# EAGLE board RK05exNew (EAGLE 6.6.0), part 1 of 2
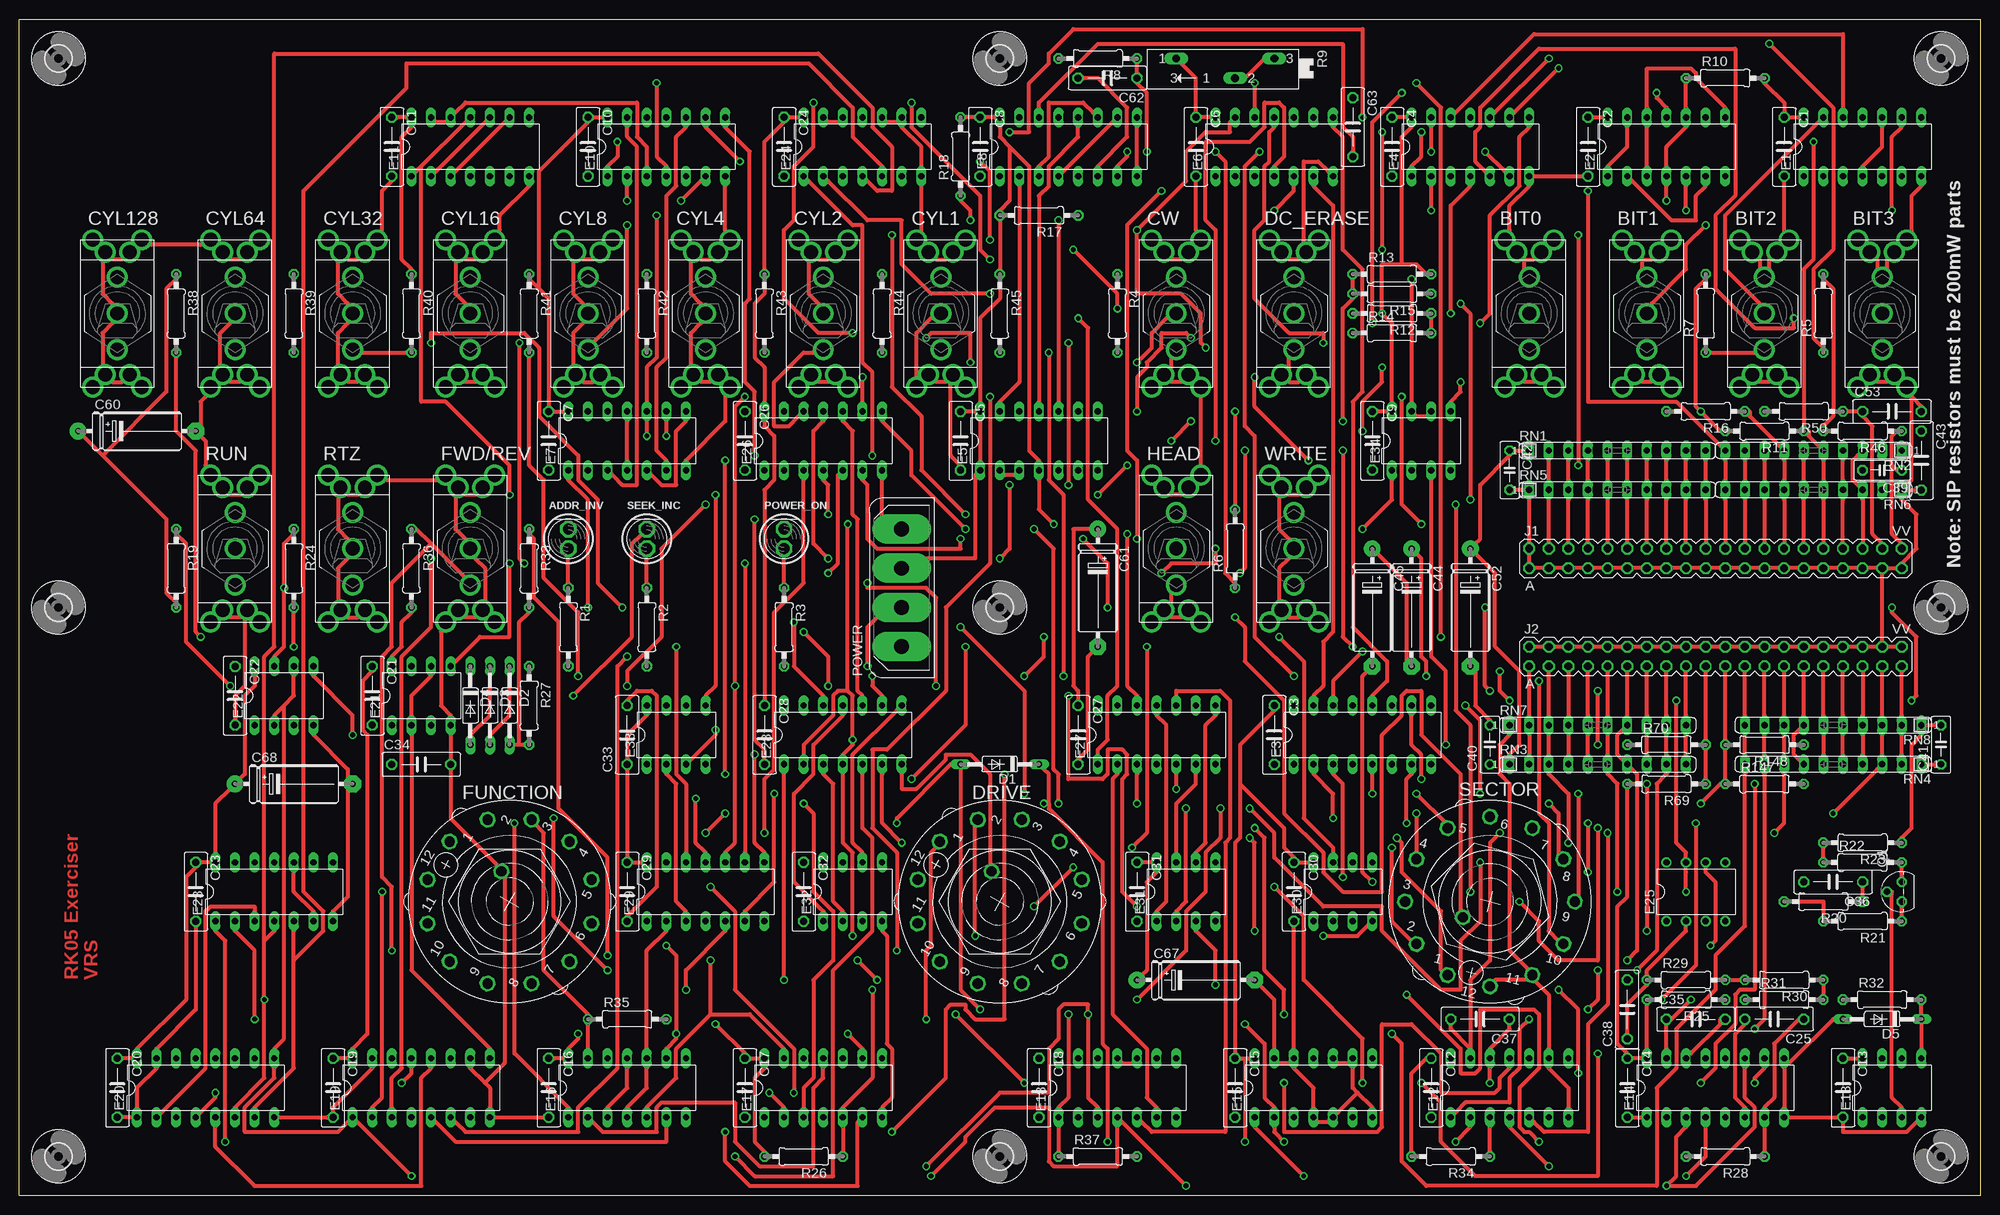
[diagram p5: board, top side]
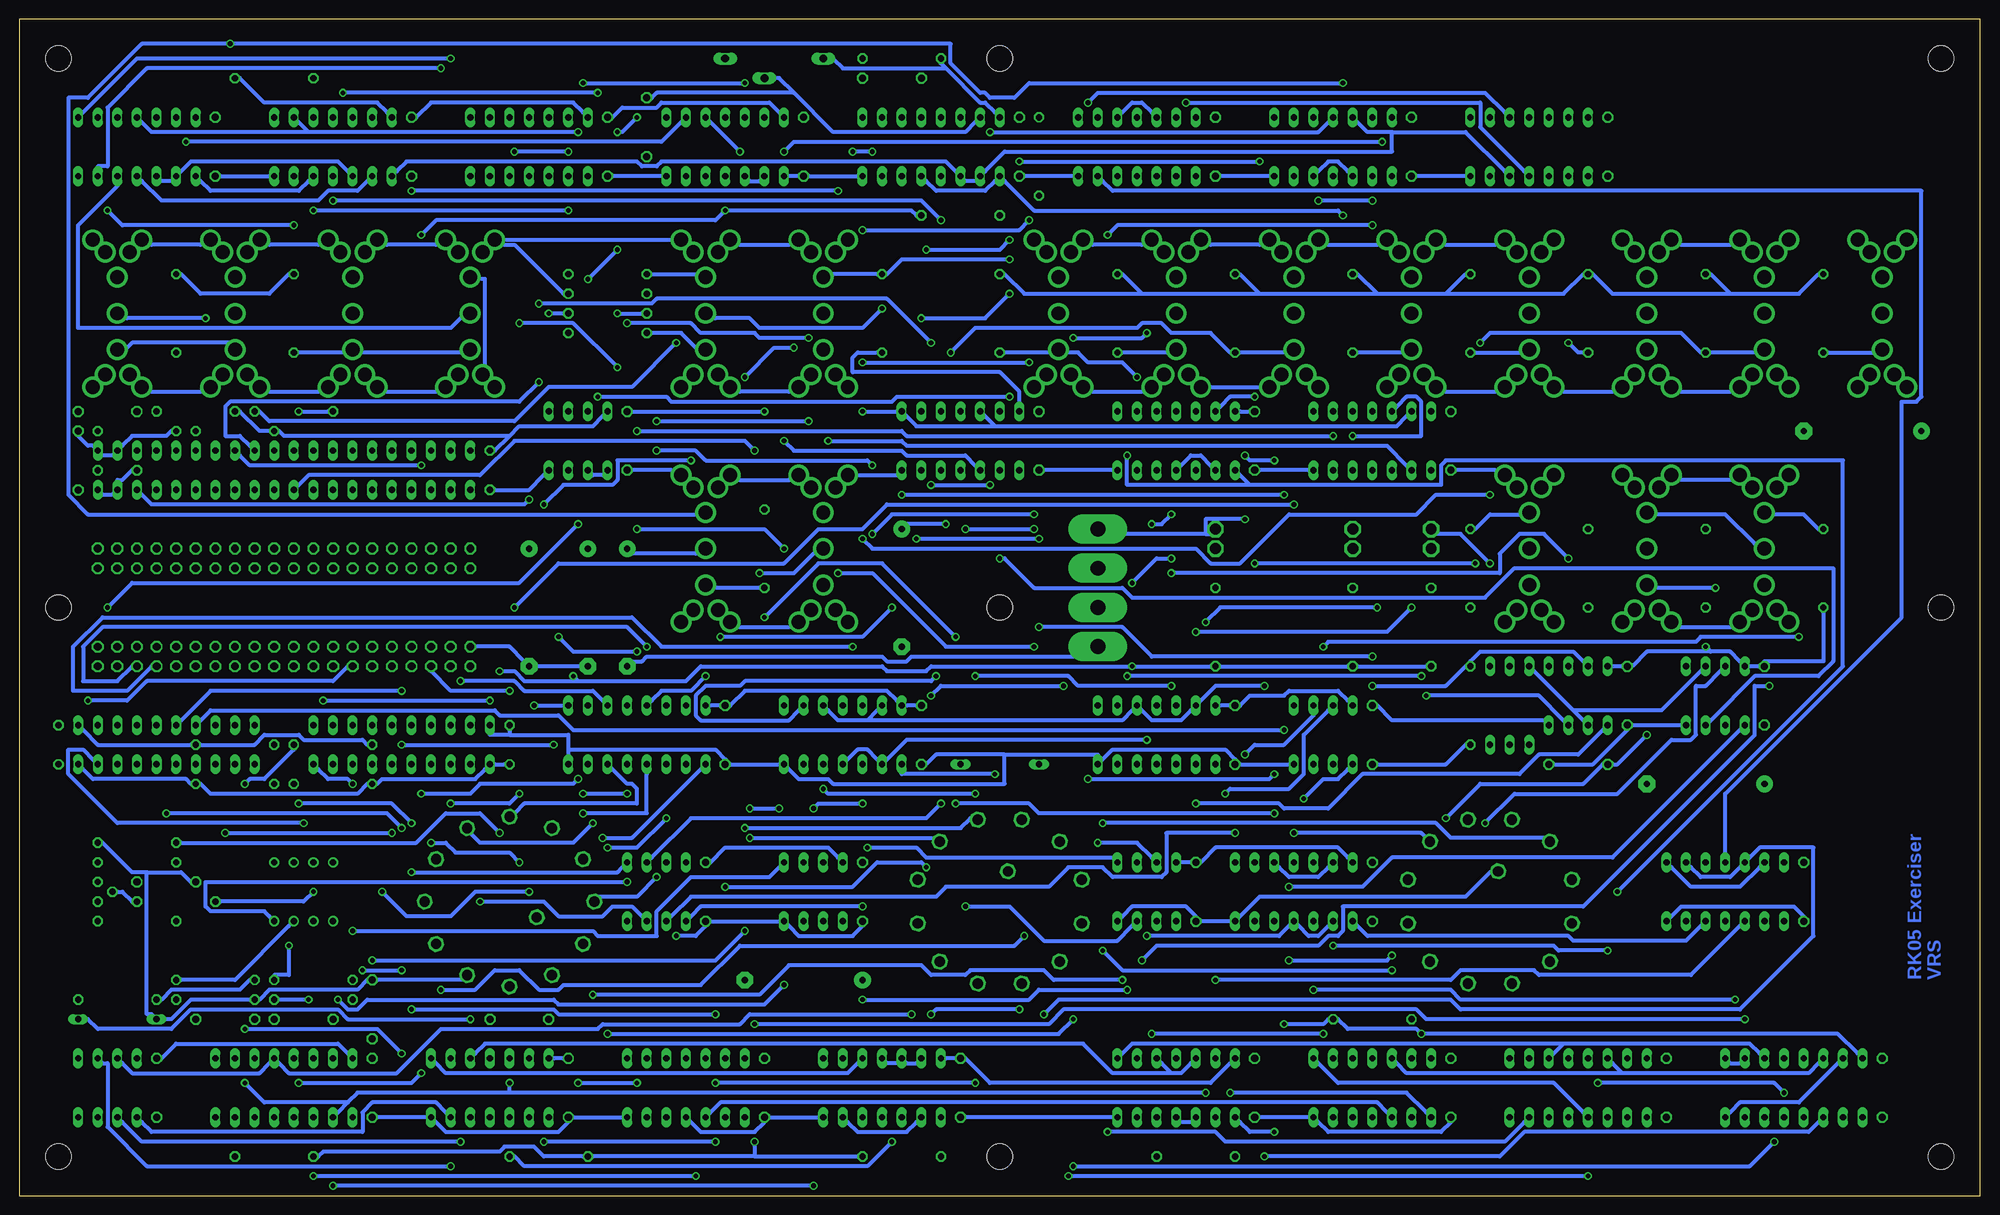
[diagram p6: board, bottom side, seen from below]

Size 254 x 152.4 mm. Coordinates in mm from the lower left corner, seen from the top.
Outline: 0,0 0,152.4 254,152.4 254,0 0,0
Copper layers (1*16): Top 0.035mm / dielectric 1.5mm / Bottom 0.035mm
Design rules "10mils *": minimum track width 10mil, minimum drill 24mil, track to track 10mil, track to pad 10mil, pad to pad 10mil, via to via 10mil, smd to smd 0mil, copper to edge 25mil, drill to drill 10mil, minimum pad ring 10mil, minimum via ring 8mil, stop-mask expansion 0mil, vias tented up to drill 0mil, thermal gap 10mil
Net classes: 0 default: width 0.508 mm, clearance 0.279 mm

## Footprints (pad centres in the part's own frame; a part is rotated, then mirrored left to right if it is on the bottom)
BULB = drill 1.422 octagon: A 0,0; B 0,2.54
7109MD9V3 = drill 1.803: 1 0,4.699; 2 0,0; 3 0,-4.699; NC@1 -3.175,9.525; NC@2 -1.587,7.938; NC@3 3.175,9.525; NC@4 1.587,7.938; NC@5 -3.175,-9.525; NC@6 -1.587,-7.938; NC@7 1.587,-7.938; NC@8 3.175,-9.525
C075-032X103 = drill 0.914 octagon: 1 -3.81,0; 2 3.81,0
C050-025X075 = drill 0.813 octagon: 1 -2.54,0; 2 2.54,0
E15-5 = drill 0.813 pad 2.159: + -7.62,0 | drill 0.813 pad 2.159 octagon: - 7.62,0
DO35-10 = drill 0.813 long: A 5.08,0; C -5.08,0
DO35Z10 = drill 0.813 long: A 5.08,0; C -5.08,0
CK101X12 = drill 1.321 octagon: 1 -2.845,-10.617; 2 -7.772,-7.772; 3 -10.617,-2.845; 4 -10.617,2.845; 5 -7.772,7.772; 6 -2.845,10.617; 7 2.845,10.617; 8 7.772,7.772; 9 10.617,2.845; 10 10.617,-2.845; 11 7.772,-7.772; 12 2.845,-10.617; A -2.87,-2.87
DIL14 = drill 0.813 long: 1 -7.62,-3.81; 2 -5.08,-3.81; 3 -2.54,-3.81; 4 0,-3.81; 5 2.54,-3.81; 6 5.08,-3.81; 7 7.62,-3.81; 8 7.62,3.81; 9 5.08,3.81; 10 2.54,3.81; 11 0,3.81; 12 -2.54,3.81; 13 -5.08,3.81; 14 -7.62,3.81
DIL16 = drill 0.813 long: 1 -8.89,-3.81; 2 -6.35,-3.81; 3 -3.81,-3.81; 4 -1.27,-3.81; 5 1.27,-3.81; 6 3.81,-3.81; 7 6.35,-3.81; 8 8.89,-3.81; 9 8.89,3.81; 10 6.35,3.81; 11 3.81,3.81; 12 1.27,3.81; 13 -1.27,3.81; 14 -3.81,3.81; 15 -6.35,3.81; 16 -8.89,3.81
DIL08 = drill 0.813 long: 1 -3.81,-3.81; 2 -1.27,-3.81; 3 1.27,-3.81; 4 3.81,-3.81; 5 3.81,3.81; 6 1.27,3.81; 7 -1.27,3.81; 8 -3.81,3.81
DIL08' = drill 0.813 pad 1.27: 1 -3.81,-3.81; 2 -1.27,-3.81; 3 1.27,-3.81; 4 3.81,-3.81; 5 3.81,3.81; 6 1.27,3.81; 7 -1.27,3.81; 8 -3.81,3.81
DEC40PINV = drill 1.016 octagon: A -24.13,-1.27; AA 3.81,-1.27; B -24.13,1.27; BB 3.81,1.27; C -21.59,-1.27; CC 6.35,-1.27; D -21.59,1.27; DD 6.35,1.27; E -19.05,-1.27; EE 8.89,-1.27; F -19.05,1.27; FF 8.89,1.27; H -16.51,-1.27; HH 11.43,-1.27; J -16.51,1.27; JJ 11.43,1.27; K -13.97,-1.27; KK 13.97,-1.27; L -13.97,1.27; LL 13.97,1.27; M -11.43,-1.27; MM 16.51,-1.27; N -11.43,1.27; NN 16.51,1.27; P -8.89,-1.27; PP 19.05,-1.27; R -8.89,1.27; RR 19.05,1.27; S -6.35,-1.27; SS 21.59,-1.27; T -6.35,1.27; TT 21.59,1.27; U -3.81,-1.27; UU 24.13,-1.27; V -3.81,1.27; VV 24.13,1.27; W -1.27,-1.27; X -1.27,1.27; Y 1.27,-1.27; Z 1.27,1.27
FLOPPY-4 = drill 1.93 pad 3.81 long: 1 7.62,0; 2 2.54,0; 3 -2.54,0; 4 -7.62,0
TO92E = drill 0.813 octagon: B1 -1.27,0; B2 1.27,0; E 0,1.905
0207/10 = drill 0.813 octagon: 1 -5.08,0; 2 5.08,0
SP19L = drill 1.016 long: A 5.715,-1.27; E -6.985,-1.27; S -1.905,1.27
SIL10 = drill 0.813 long: 1 -11.43,0; 2 -8.89,0; 3 -6.35,0; 4 -3.81,0; 5 -1.27,0; 6 1.27,0; 7 3.81,0; 8 6.35,0; 9 8.89,0; 10 11.43,0
3,3 = hole 3.3: 0,0

## Placement (x,y rotation side)
ADDR_INV  [BULB]  71.12,83.82 0 top
BIT0  7101  [7109MD9V3]  195.58,114.3 0 top
BIT1  7101  [7109MD9V3]  210.82,114.3 0 top
BIT2  7101  [7109MD9V3]  226.06,114.3 0 top
BIT3  7101  [7109MD9V3]  241.3,114.3 0 top
C1  .01uf  [C075-032X103]  228.6,135.89 270 top
C2  .01uf  [C075-032X103]  203.2,135.89 270 top
C3  .01uf  [C075-032X103]  162.56,59.69 270 top
C4  .01uf  [C075-032X103]  177.8,135.89 270 top
C5  .01uf  [C075-032X103]  121.92,97.79 270 top
C6  .01uf  [C075-032X103]  152.4,135.89 270 top
C7  .01uf  [C075-032X103]  68.58,97.79 270 top
C8  .01uf  [C075-032X103]  124.46,135.89 270 top
C9  .01uf  [C075-032X103]  175.26,97.79 270 top
C10  .01uf  [C075-032X103]  73.66,135.89 270 top
C11  .01uf  [C075-032X103]  48.26,135.89 270 top
C12  .01uf  [C075-032X103]  182.88,13.97 270 top
C13  .01uf  [C075-032X103]  236.22,13.97 270 top
C14  .01uf  [C075-032X103]  208.28,13.97 270 top
C15  .01uf  [C075-032X103]  157.48,13.97 270 top
C16  .01uf  [C075-032X103]  68.58,13.97 270 top
C17  .01uf  [C075-032X103]  93.98,13.97 270 top
C18  .01uf  [C075-032X103]  132.08,13.97 270 top
C19  .01uf  [C075-032X103]  40.64,13.97 270 top
C20  .01uf  [C075-032X103]  12.7,13.97 270 top
C21  .01uf  [C075-032X103]  45.72,64.77 270 top
C22  .01uf  [C075-032X103]  27.94,64.77 270 top
C23  .01uf  [C075-032X103]  22.86,39.37 270 top
C24  .01uf  [C075-032X103]  99.06,135.89 270 top
C25  470pf  [C075-032X103]  227.33,22.86 180 top
C26  .01uf  [C075-032X103]  93.98,97.79 270 top
C27  .01uf  [C075-032X103]  137.16,59.69 270 top
C28  .01uf  [C075-032X103]  96.52,59.69 270 top
C29  .01uf  [C075-032X103]  78.74,39.37 270 top
C30  .01uf  [C075-032X103]  165.1,39.37 270 top
C31  .01uf  [C075-032X103]  144.78,39.37 270 top
C32  .01uf  [C075-032X103]  101.6,39.37 270 top
C33  .01uf  [C075-032X103]  78.74,59.69 90 top
C34  .001uf  [C075-032X103]  52.07,55.88 0 top
C35  470pf  [C075-032X103]  217.17,22.86 0 top
C36  .033uf  [C075-032X103]  234.95,40.64 180 top
C37  .001uf  [C075-032X103]  189.23,22.86 180 top
C38  100pf  [C075-032X103]  208.28,24.13 90 top
C39  .001  [C050-025X075]  241.3,93.98 180 top
C40  .22uf  [C050-025X075]  190.5,58.42 90 top
C41  .22uf  [C050-025X075]  248.92,58.42 90 top
C42  .22uf  [C050-025X075]  193.04,93.98 270 top
C43  .22uf  [C075-032X103]  246.38,95.25 270 top
C44  6.8uf  [E15-5]  180.34,76.2 270 top
C45  6.8uf  [E15-5]  175.26,76.2 270 top
C52  39uf  [E15-5]  187.96,76.2 270 top
C53  .001  [C075-032X103]  242.57,101.6 0 top
C60  6.8uf  [E15-5]  15.24,99.06 0 top
C61  6.8uf  [E15-5]  139.7,78.74 270 top
C62  27pf  [C075-032X103]  140.97,144.78 180 top
C63  47pf  [C075-032X103]  172.72,138.43 270 top
C67  6.8uf  [E15-5]  152.4,27.94 0 top
C68  6.8uf  [E15-5]  35.56,53.34 0 top
CW  7101  [7109MD9V3]  149.86,114.3 0 top
CYL1  7101  [7109MD9V3]  119.38,114.3 0 top
CYL2  7101  [7109MD9V3]  104.14,114.3 0 top
CYL4  7101  [7109MD9V3]  88.9,114.3 0 top
CYL8  7101  [7109MD9V3]  73.66,114.3 0 top
CYL16  7101  [7109MD9V3]  58.42,114.3 0 top
CYL32  7101  [7109MD9V3]  43.18,114.3 0 top
CYL64  7101  [7109MD9V3]  27.94,114.3 0 top
CYL128  7101  [7109MD9V3]  12.7,114.3 0 top
D1  D664  [DO35-10]  127,55.88 180 top
D2  D664  [DO35-10]  63.5,63.5 270 top
D3  D664  [DO35-10]  60.96,63.5 270 top
D4  D664  [DO35-10]  58.42,63.5 270 top
D5  1N746  [DO35Z10]  241.3,22.86 180 top
DC_ERASE  7101  [7109MD9V3]  165.1,114.3 0 top
DRIVE  [CK101X12]  127,38.1 240 top
E1  74LS10N  [DIL14]  238.76,135.89 0 top
E2  74LS74N  [DIL14]  213.36,135.89 0 top
E3  74LS42N  [DIL16]  173.99,59.69 0 top
E4  74LS20N  [DIL14]  187.96,135.89 0 top
E5  74LS74N  [DIL14]  132.08,97.79 0 top
E6  74LS04N  [DIL14]  162.56,135.89 0 top
E7  74LS00N  [DIL14]  78.74,97.79 0 top
E8  74123N  [DIL16]  135.89,135.89 0 top
E10  74LS00N  [DIL14]  83.82,135.89 0 top
E11  74LS74N  [DIL14]  58.42,135.89 0 top
E12  74LS04N  [DIL14]  193.04,13.97 0 top
E13  DS75451N  [DIL08]  242.57,13.97 0 top
E14  74123N  [DIL16]  219.71,13.97 0 top
E15  74LS00N  [DIL14]  167.64,13.97 0 top
E16  74LS10N  [DIL14]  78.74,13.97 0 top
E17  74LS00N  [DIL14]  104.14,13.97 0 top
E18  74LS74N  [DIL14]  142.24,13.97 0 top
E19  74LS193N  [DIL16]  52.07,13.97 0 top
E20  74LS193N  [DIL16]  24.13,13.97 0 top
E21  DS75451N  [DIL08]  52.07,64.77 0 top
E22  DS75451N  [DIL08]  34.29,64.77 0 top
E23  74LS10N  [DIL14]  33.02,39.37 0 top
E24  74LS20N  [DIL14]  109.22,135.89 0 top
E25  LM741P  [DIL08']  217.17,39.37 0 top
E26  74LS00N  [DIL14]  104.14,97.79 0 top
E27  74LS00N  [DIL14]  147.32,59.69 0 top
E28  74LS00N  [DIL14]  106.68,59.69 0 top
E29  74LS00N  [DIL14]  88.9,39.37 0 top
E30  DS75451N  [DIL08]  171.45,39.37 0 top
E31  DS75451N  [DIL08]  151.13,39.37 0 top
E32  DS75451N  [DIL08]  107.95,39.37 0 top
E33  DS75451N  [DIL08]  85.09,59.69 0 top
E34  DS75451N  [DIL08]  181.61,97.79 0 top
FUNCTION  [CK101X12]  63.5,38.1 240 top
FWD/REV  7101  [7109MD9V3]  58.42,83.82 0 top
HEAD  7101  [7109MD9V3]  149.86,83.82 0 top
J1  DEC40PINSV  [DEC40PINV]  219.71,82.55 0 top
J2  DEC40PINSV  [DEC40PINV]  219.71,69.85 0 top
POWER  [FLOPPY-4]  114.3,78.74 90 top
POWER_ON  [BULB]  99.06,83.82 0 top
Q1  2N4894  [TO92E]  243.84,39.37 90 top
R1  0ohm  [0207/10]  71.12,73.66 270 top
R2  0ohm  [0207/10]  81.28,73.66 270 top
R3  0ohm  [0207/10]  99.06,73.66 270 top
R4  1K  [0207/10]  142.24,114.3 270 top
R5  56K  [0207/10]  233.68,114.3 90 top
R6  56K  [0207/10]  157.48,83.82 90 top
R7  1K  [0207/10]  218.44,114.3 90 top
R8  5.6k  [0207/10]  139.7,147.32 180 top
R9  10K  [SP19L]  155.57,146.05 180 top
R10  1K  [0207/10]  220.98,144.78 0 top
R11  1K  [0207/10]  226.06,99.06 180 top
R12  330  [0207/10]  177.8,114.3 180 top
R13  330  [0207/10]  177.8,119.38 0 top
R14  750  [0207/10]  177.8,111.76 0 top
R15  750  [0207/10]  177.8,116.84 180 top
R16  1K  [0207/10]  218.44,101.6 180 top
R17  1K  [0207/10]  132.08,127 180 top
R18  1K  [0207/10]  121.92,134.62 90 top
R19  1K  [0207/10]  20.32,81.28 270 top
R20  470K  [0207/10]  233.68,38.1 180 top
R21  330  [0207/10]  238.76,35.56 180 top
R22  120  [0207/10]  238.76,43.18 0 top
R23  68  [0207/10]  238.76,45.72 180 top
R24  1K  [0207/10]  35.56,81.28 270 top
R25  10K  [0207/10]  215.9,25.4 180 top
R26  1K  [0207/10]  101.6,5.08 180 top
R27  1K  [0207/10]  66.04,63.5 270 top
R28  22K  [0207/10]  220.98,5.08 180 top
R29  100K  [0207/10]  215.9,27.94 0 top
R30  100K  [0207/10]  228.6,27.94 180 top
R31  1M  [0207/10]  228.6,25.4 0 top
R32  1K  [0207/10]  241.3,25.4 0 top
R33  1K  [0207/10]  66.04,81.28 270 top
R34  1K  [0207/10]  185.42,5.08 180 top
R35  1K  [0207/10]  78.74,22.86 0 top
R36  1K  [0207/10]  50.8,81.28 270 top
R37  1K  [0207/10]  139.7,5.08 0 top
R38  1K  [0207/10]  20.32,114.3 270 top
R39  1K  [0207/10]  35.56,114.3 270 top
R40  1K  [0207/10]  50.8,114.3 270 top
R41  1K  [0207/10]  66.04,114.3 270 top
R42  1K  [0207/10]  81.28,114.3 270 top
R43  1K  [0207/10]  96.52,114.3 270 top
R44  1K  [0207/10]  111.76,114.3 270 top
R45  1K  [0207/10]  127,114.3 270 top
R46  390  [0207/10]  238.76,99.06 180 top
R50  390  [0207/10]  231.14,101.6 180 top
R69  180  [0207/10]  213.36,53.34 180 top
R70  390  [0207/10]  213.36,58.42 0 top
R147  180  [0207/10]  226.06,53.34 0 top
R148  390  [0207/10]  226.06,58.42 180 top
RN1  180  [SIL10]  207.01,96.52 0 top
RN2  180  [SIL10]  232.41,96.52 180 top
RN3  180  [SIL10]  204.47,55.88 0 top
RN4  180  [SIL10]  234.95,55.88 180 top
RN5  390  [SIL10]  207.01,91.44 0 top
RN6  390  [SIL10]  232.41,91.44 180 top
RN7  390  [SIL10]  204.47,60.96 0 top
RN8  390  [SIL10]  234.95,60.96 180 top
RTZ  7101  [7109MD9V3]  43.18,83.82 0 top
RUN  7101  [7109MD9V3]  27.94,83.82 0 top
SECTOR  [CK101X12]  190.5,38.1 345 top
SEEK_INC  [BULB]  81.28,83.82 0 top
U$1  [3,3]  5.08,147.32 0 top
U$2  [3,3]  5.08,5.08 0 top
U$3  [3,3]  5.08,76.2 0 top
U$4  [3,3]  248.92,147.32 0 top
U$5  [3,3]  248.92,5.08 0 top
U$6  [3,3]  248.92,76.2 0 top
U$7  [3,3]  127,147.32 0 top
U$8  [3,3]  127,5.08 0 top
U$9  [3,3]  127,76.2 0 top
WRITE  7108  [7109MD9V3]  165.1,83.82 0 top

## Tracks (layer width: path | path; a pad name or v marks a point on that pad's centre or on a via)
0BIT  (via drill 0.61)
  Top 0.508: v199.39,146.05 193.68,140.34 E4.9
  Bottom 0.508: v199.39,146.05 237.49,146.05 242.57,140.97 242.57,133.35 243.84,133.35 E1.6
1.44MHZ
  Top 0.508: E5.11 132.08,102.87 132.08,129.54 133.35,130.81 133.35,133.35 137.16,137.16 137.16,138.43 E8.12
1BIT  (via drill 0.61)
  Top 0.508: v198.12,147.32 191.13,140.34 E4.10
  Bottom 0.508: v198.12,147.32 238.76,147.32 245.75,140.34 E1.8
1L  (via drill 0.61)
  Top 0.508: v212.09,142.88 212.09,142.24 213.36,140.97 E2.11 | v179.07,142.88 175.26,139.06 v175.26,113.03 | v151.76,111.12 151.13,111.76 147.96,111.76 147.96,109.86 146.05,107.95 146.05,107.31 144.78,106.05 v144.78,101.6
  Bottom 0.508: 127.64,99.69 75.56,99.69 74.3,100.97 E7.13 | 127.64,99.69 128.91,100.97 E5.12 | 127.64,99.69 137.79,99.69 139.06,100.97 E5.8 140.34,101.6 v144.78,101.6 | v179.07,142.88 v212.09,142.88 | v175.26,113.03 167,113.03 165.74,111.76 158.75,111.76 158.12,111.12 v151.76,111.12
2.88MHZ
  Top 0.508: E8.4 135.25,132.72 141.6,139.06 E8.10
2BIT
  Top 0.508: E4.12 186.06,140.34 196.22,150.5 236.22,150.5 236.22,140.97 E1.12
2H  (via drill 0.61)
  Top 0.508: v181.61,137.79 181.61,134.62 180.34,133.35 E4.1
  Bottom 0.508: v181.61,137.79 216.53,137.79 | 216.53,137.79 217.81,139.06 E2.9 | 216.53,137.79 236.85,137.79 238.12,139.06 E1.11
2L
  Top 0.508: E2.3 210.82,133.35 210.82,138.43 E2.12 210.82,140.97 210.82,146.05 216.53,146.05 217.17,145.41 217.17,144.78 220.98,140.97 E2.8
  Bottom 0.508: E1.3 235.59,131.44 234.31,131.44 E1.2 233.04,132.72 231.78,133.99 212.72,133.99 211.46,132.72 E2.3
3BIT  (via drill 0.61)
  Top 0.508: v182.88,135.25 182.88,138.43 E4.13 | v189.87,135.25 192.41,132.72 E4.6
  Bottom 0.508: v182.88,135.25 v189.87,135.25
4H  (via drill 0.61)
  Top 0.508: v182.88,127.64 182.88,130.81 E4.2 | v215.9,127.64 215.9,130.81 E2.5
  Bottom 0.508: v182.88,127.64 v215.9,127.64 | E1.1 230.5,131.44 229.24,130.18 217.81,130.18 216.53,131.44 E2.5
4L
  Top 0.508: E1.4 238.76,133.35 241.3,135.89 241.3,138.43 E1.10 | E2.2 208.91,131.44 214,126.36 217.17,126.36 217.17,129.54 218.44,130.81 E2.6
  Bottom 0.508: E1.4 238.12,131.44 235.59,128.91 215.26,128.91 214,130.18 210.19,130.18 208.91,131.44 E2.2
202_DETECT_L
  Bottom 0.508: E23.11 33.02,44.45 33.02,52.07 10.16,74.93 10.16,102.87 8.26,102.87 7.62,103.5 7.62,130.18 112.39,130.18 113.67,131.44 E24.6
+3V  (via drill 0.61)
  Top 0.508: 34.29,63.5 35.56,64.77 35.56,67.31 E22.6 | 34.29,63.5 33.02,62.23 E22.2 | E19.9 60.96,19.05 50.8,29.21 50.8,59.69 E21.2 50.8,62.23 50.8,64.77 53.34,67.31 E21.6 | 34.29,63.5 34.29,20.32 33.02,19.05 E20.9 33.02,16.51 33.02,15.24 29.21,11.43 29.21,8.26 41.27,8.26 42.55,9.53 E19.1 43.81,9.53 v50.8,2.54 | v151.13,1.27 142.88,9.53 E18.4 142.24,8.89 142.24,3.81 133.99,3.81 133.35,4.45 133.35,11.43 126.36,11.43 122.56,7.62 122.56,6.99 v118.11,2.54 | E14.3 215.9,8.89 214.63,7.62 214.63,2.54 v213.36,1.27 217.17,1.27 224.79,8.89 224.79,11.43 223.52,12.7 223.52,16.51 E14.11
  Bottom 0.508: E20.10 31.11,17.14 32.38,17.14 E20.9 | 52.7,62.87 51.44,61.59 E21.2 | 52.7,62.87 57.78,67.94 D4.C | 52.7,62.87 41.27,62.87 36.2,67.94 E22.6 | v151.13,1.27 v213.36,1.27 | v50.8,2.54 v118.11,2.54
+3VA  (via drill 0.61)
  Top 0.508: v151.76,100.33 v149.22,97.79 | v171.45,100.33 171.45,114.94 172.72,116.2 R15.2 172.72,117.47 172.72,118.75 R13.1
  Bottom 0.508: v149.22,97.79 139.7,97.79 139.06,97.16 76.83,97.16 74.3,94.61 E7.2 | v171.45,100.33 v151.76,100.33 | DC_ERASE.1 166.37,119.38 172.09,119.38 R13.1
+3VB  (via drill 0.61)
  Top 0.508: R14.2 182.88,112.39 182.88,113.67 R12.1 | v185.42,114.3 185.42,128.27 187.96,130.81 E4.4
  Bottom 0.508: v185.42,114.3 183.51,114.3 R12.1
+3VC  (via drill 0.61)
  Top 0.508: E11.2 53.98,132.72 60.33,139.06 E11.10 | v125.73,121.28 124.46,122.56 124.46,129.54 115.57,138.43 v115.57,141.6
  Bottom 0.508: CW.1 148.59,119.38 142.88,119.38 R4.1 141.6,119.38 139.7,121.28 v125.73,121.28 | v115.57,141.6 114.3,142.88 64.14,142.88 61.59,140.34 E11.10
+15V  (via drill 0.61)
  Top 0.508: R20.2 229.24,38.1 233.68,38.1 233.68,36.2 R21.2 | v215.9,39.37 215.9,41.91 E25.7 215.9,44.45 214.63,45.72 v214.63,64.14 | v182.25,67.31 182.25,69.22 181.61,69.85 181.61,82.55 180.97,83.19 C44.+ | v109.86,68.58 109.86,73.66 111.12,74.93 POWER.3 | v193.04,64.14 191.77,65.41 v191.77,67.94
  Bottom 0.508: v215.9,39.37 217.17,38.1 227.97,38.1 R20.2 | R1.2 71.75,68.58 80.64,68.58 R2.2 81.92,68.58 98.42,68.58 R3.2 99.69,68.58 v109.86,68.58 135.89,68.58 136.53,67.94 141.6,67.94 142.24,68.58 165.74,68.58 167.64,66.67 181.61,66.67 | 181.61,66.67 v182.25,67.31 | v214.63,64.14 v193.04,64.14 | v191.77,67.94 189.87,67.94 188.59,66.67 181.61,66.67
-15V  (via drill 0.61)
  Top 0.508: v175.26,40.64 173.99,41.91 173.99,67.31 174.62,67.94 C45.-
  Bottom 0.508: v175.26,40.64 229.87,40.64 229.87,37.47 229.24,36.83 222.25,36.83 221.62,36.2 E25.4 | POWER.4 117.47,69.85 138.43,69.85 139.06,69.22 141.6,69.22 142.24,69.85 172.72,69.85 173.35,69.22 174.62,69.22 C45.-
ADDR_COUNTER_1  (via drill 0.61)
  Top 0.508: v53.34,82.55 53.34,73.66 49.53,69.85 49.53,16.51 48.26,15.24 48.26,11.43 E19.3 | v104.78,80.64 106.05,81.92 106.05,93.34 E26.5
  Bottom 0.508: v53.34,82.55 56.52,85.72 59.69,85.72 62.23,83.19 62.23,80.64 v104.78,80.64
ADDR_COUNTER_2  (via drill 0.61)
  Top 0.508: v46.99,39.37 46.99,12.7 45.72,11.43 E19.2 | v110.49,95.89 110.49,106.68 109.22,107.95 109.22,125.73 107.95,125.73 102.23,131.44 E24.1
  Bottom 0.508: v46.99,39.37 17.78,68.58 17.78,95.25 69.22,95.25 69.85,94.61 69.85,92.08 94.61,92.08 | 94.61,92.08 95.89,93.34 E26.1 | v110.49,95.89 110.49,92.08 94.61,92.08
ADDR_COUNTER_4  (via drill 0.61)
  Top 0.508: v78.74,69.85 77.47,68.58 77.47,16.51 72.39,11.43 72.39,8.26 57.78,8.26 56.52,9.53 E19.6 | v121.92,73.66 130.18,65.41 v130.18,52.07 | v149.86,52.7 149.86,54.61 E27.5
  Bottom 0.508: v78.74,69.85 107.31,69.85 111.12,73.66 v121.92,73.66 | v130.18,52.07 149.22,52.07 v149.86,52.7
ADDR_COUNTER_8  (via drill 0.61)
  Top 0.508: v113.03,8.26 120.02,15.24 120.02,24.13 120.65,24.77 122.56,24.77 122.56,24.13 123.83,22.86 127.64,22.86 v127.64,54.61 | v125.73,116.84 118.11,116.84 114.3,120.65 114.3,126.36 109.86,126.36 104.78,131.44 E24.2 | v137.16,113.67 138.43,112.39 138.43,90.17 142.24,86.36 142.24,66.04 140.97,64.77 140.97,59.05 139.7,57.78 139.7,57.15 E27.1
  Bottom 0.508: v113.03,8.26 99.06,8.26 97.79,6.99 61.59,6.99 59.05,9.53 E19.7 | v127.64,54.61 139.7,54.61 E27.1 | v125.73,116.84 128.91,113.67 v137.16,113.67
ADDR_COUNTER_16  (via drill 0.61)
  Top 0.508: v92.71,5.08 95.25,2.54 105.41,2.54 105.41,29.21 110.49,34.29 110.49,46.35 109.22,47.62 109.22,54.61 E28.5
  Bottom 0.508: v92.71,5.08 62.23,5.08 59.05,8.26 22.23,8.26 20.95,9.53 E20.3
ADDR_COUNTER_32  (via drill 0.61)
  Top 0.508: E20.2 18.41,10.79 24.13,16.51 24.13,36.83 24.77,37.47 30.48,37.47 30.48,36.83 E23.3 | v99.06,27.94 99.06,54.61 E28.1
  Bottom 0.508: v99.06,27.94 68.58,27.94 67.31,29.21 57.78,29.21 57.15,28.57 37.47,28.57 31.11,34.92 E23.3
ADDR_COUNTER_64  (via drill 0.61)
  Top 0.508: 31.75,33.02 v31.75,25.4 31.75,15.24 27.94,11.43 E20.6 | 31.75,33.02 33.02,34.29 E23.4 | v86.36,26.67 86.36,29.21 91.44,34.29 E29.5 | 31.75,33.02 31.75,69.85 33.02,71.12 33.02,147.96 103.5,147.96 110.49,140.97 110.49,138.43 113.03,135.89 113.03,130.18 111.12,130.18 109.86,131.44 E24.4
  Bottom 0.508: v86.36,26.67 68.58,26.67 67.31,25.4 v31.75,25.4
ADDR_COUNTER_128
  Top 0.508: 35.56,30.48 35.56,34.29 E23.5 | 35.56,30.48 35.56,16.51 30.48,11.43 E20.7 | 35.56,30.48 39.37,34.29 39.37,36.83 36.83,39.37 36.83,130.18 50.16,143.51 50.16,146.69 102.23,146.69 107.95,140.97 107.95,137.16 111.76,133.35 E24.5
  Bottom 0.508: E29.1 80.64,34.92 79.38,33.66 53.34,33.66 52.7,33.02 38.1,33.02 36.2,34.92 E23.5
ADDR_SOURCE_H  (via drill 0.61)
  Top 0.508: v93.98,103.5 92.71,102.23 v92.71,66.04 92.71,45.72 91.44,44.45 E29.10 | E26.10 106.68,100.33 107.95,99.06 107.95,88.27 108.58,87.63 108.58,65.41 109.22,64.77 E28.10 | E18.5 145.41,9.53 146.69,8.26 156.21,8.26 156.21,45.72 156.84,46.35 156.84,64.14 155.57,65.41 149.86,65.41 149.86,64.77 E27.10
  Bottom 0.508: E29.13 84.45,42.55 85.72,41.27 89.53,41.27 90.81,42.55 E29.10 | v93.98,103.5 97.16,103.5 98.42,102.23 E26.13 | 144.15,61.59 142.88,62.87 E27.13 | 144.15,61.59 147.96,61.59 149.22,62.87 E27.10 | 144.15,61.59 111.12,61.59 109.86,62.87 E28.10 108.58,62.87 107.31,61.59 103.5,61.59 102.23,62.87 E28.13 100.97,64.14 99.06,66.04 v92.71,66.04
ADDR_SOURCE_L  (via drill 0.61)
  Top 0.508: E27.2 142.24,54.61 141.6,53.98 141.6,23.5 146.05,19.05 146.05,12.7 147.32,11.43 E18.6 | E16.4 78.74,11.43 81.28,13.97 81.28,16.51 E16.10 81.28,19.05 81.28,31.75 83.82,34.29 E29.2 | 107.31,65.41 106.05,65.41 105.41,64.77 105.41,62.23 101.6,58.42 101.6,57.15 E28.2 | 107.31,65.41 107.95,64.77 v107.95,59.05 107.95,58.42 106.68,57.15 E28.4 106.68,54.61 106.68,45.72 107.95,44.45 v107.95,33.66 | v104.78,88.27 104.78,92.08 104.14,92.71 E26.4 | 107.31,65.41 v107.31,87
  Bottom 0.508: E27.4 146.69,56.52 145.41,57.78 144.15,57.78 142.88,56.52 E27.2 141.6,56.52 139.06,59.05 v107.95,59.05 | E18.2 137.79,9.53 139.06,8.26 145.41,8.26 146.69,9.53 E18.6 | E29.2 84.45,34.92 85.72,33.66 87,33.66 88.27,34.92 E29.4 89.53,34.92 90.81,33.66 v107.95,33.66 | E26.2 99.69,94.61 100.97,95.89 102.23,95.89 103.5,94.61 E26.4 | v104.78,88.27 106.05,87 v107.31,87
ADDRESS_INVALID_L  (via drill 0.61)
  Top 0.508: v63.5,81.92 63.5,72.39 59.69,72.39 56.52,69.22 E21.5
  Bottom 0.508: v63.5,81.92 67.31,85.72 70.48,85.72 ADDR_INV.B
BIT_0L
  Bottom 0.508: E1.5 241.3,130.81 246.38,125.73 246.38,112.39 198.12,112.39 196.85,113.67 BIT0.2
BIT_1L  (via drill 0.61)
  Top 0.508: v242.57,127.64 242.57,137.16 243.84,138.43 E1.9 | v218.44,125.73 215.9,123.19 215.9,120.02 211.46,115.57 BIT1.2
  Bottom 0.508: v242.57,127.64 240.66,125.73 v218.44,125.73
BIT_2L
  Top 0.508: E1.13 233.04,139.06 220.98,127 220.98,120.02 225.43,115.57 BIT2.2
BIT_3L  (via drill 0.61)
  Top 0.508: v229.87,113.67 229.87,112.39 224.79,112.39 219.71,117.47 219.71,127 222.25,129.54 222.25,148.59 196.85,148.59 189.23,140.97 189.23,138.43 188.59,137.79 188.59,133.99 189.87,132.72 E4.5
  Bottom 0.508: v229.87,113.67 240.03,113.67 BIT3.2
BUS_AC_LO_L
  Top 0.508: 242.57,94.61 243.21,93.98 C39.1 | 242.57,94.61 242.57,98.42 243.21,99.06 R46.1 | 242.57,94.61 242.57,85.72 243.84,84.45 J1.VV
BUS_ADDR_ACCEPTED_L
  Top 0.508: RN3.5 203.2,57.15 203.2,59.69 RN7.5 203.2,62.23 203.2,67.94 J2.H
BUS_ADDRESS_INVALID_L  (via drill 0.61)
  Top 0.508: R26.1 106.68,5.71 106.68,8.89 E17.5 106.68,11.43 110.49,15.24 v110.49,26.67 | J2.C 198.12,67.94 198.12,62.23 RN7.3 198.12,59.69 198.12,57.15 RN3.3 198.12,54.61 200.66,52.07 v200.66,45.72 | v144.78,25.4 151.13,31.75 151.13,36.83 153.67,39.37 153.67,44.45 155.57,46.35 v155.57,50.16 | v159.38,50.16 162.56,46.99 162.56,43.81 168.91,37.47 176.53,37.47 176.53,34.29 184.15,26.67 186.69,26.67 186.69,33.02 189.23,35.56 v189.23,43.18
  Bottom 0.508: v110.49,26.67 121.92,26.67 123.19,25.4 v144.78,25.4 | v159.38,50.16 v155.57,50.16 | v189.23,43.18 190.5,44.45 197.49,44.45 198.75,45.72 v200.66,45.72
BUS_CA_00_L  (via drill 0.61)
  Top 0.508: v203.2,48.26 v203.2,41.91 | v217.81,50.8 220.34,53.34 R147.1 220.98,53.98 220.98,57.78 R148.2 220.98,59.05 220.98,67.94 J2.Y
  Bottom 0.508: v203.2,41.91 176.53,41.91 175.9,42.55 E30.5 | v203.2,48.26 205.74,50.8 v217.81,50.8
BUS_CA_01_L  (via drill 0.61)
  Top 0.508: v194.31,38.1 196.85,35.56 196.85,33.02 199.39,30.48 204.47,30.48 v204.47,47.62 | v234.95,49.53 240.66,55.24 RN4.3 241.3,57.15 241.3,59.69 RN8.3 241.3,62.23 241.3,67.94 J2.SS
  Bottom 0.508: v194.31,38.1 186.06,38.1 184.15,36.2 178.44,36.2 177.16,37.47 174.62,37.47 173.35,36.2 E30.3 | v204.47,47.62 206.38,49.53 v234.95,49.53
BUS_CA_02_L  (via drill 0.61)
  Top 0.508: v210.82,53.34 v210.82,34.29 | RN3.10 215.9,57.15 215.9,59.69 RN7.10 215.9,62.23 215.9,67.94 J2.U
  Bottom 0.508: v210.82,34.29 179.71,34.29 179.07,33.66 171.45,33.66 171.45,36.83 167,41.27 156.84,41.27 155.57,42.55 E31.5 | v210.82,53.34 211.46,53.98 214,53.98 215.26,55.24 RN3.10
BUS_CA_03_L  (via drill 0.61)
  Top 0.508: v154.94,27.3 154.94,31.75 152.4,34.29 E31.3 | v212.72,25.4 217.17,29.84 v217.17,48.26 | RN4.2 243.84,57.15 243.84,59.69 RN8.2 243.84,62.23 243.84,67.94 J2.UU
  Bottom 0.508: v154.94,27.3 157.48,24.77 184.15,24.77 184.78,25.4 208.91,25.4 210.19,24.13 211.46,24.13 v212.72,25.4 | v217.17,48.26 241.3,48.26 247.65,54.61 247.65,57.78 245.75,57.78 244.47,56.52 RN4.2
BUS_CA_04_L  (via drill 0.61)
  Top 0.508: RN4.5 236.22,57.15 236.22,59.69 RN8.5 236.22,62.23 236.22,67.94 J2.MM | v144.15,45.09 146.05,46.99 v146.05,71.12
  Bottom 0.508: v144.15,45.09 137.79,45.09 136.53,43.81 112.39,43.81 E32.5 | v146.05,71.12 170.81,71.12 174.62,74.93 243.21,74.93 247.01,71.12 247.01,65.41 240.03,65.41 236.85,68.58 J2.MM
BUS_CA_05_L  (via drill 0.61)
  Top 0.508: v136.53,42.55 v131.44,37.47 | v162.56,40.01 166.37,36.2 166.37,27.94 173.99,20.32 v173.99,14.61 | v181.61,14.61 184.15,12.06 184.15,6.99 188.59,2.54 204.47,2.54 v204.47,18.41 | v224.79,21.59 226.06,22.86 226.06,54.61 RN4.9 226.06,57.15 226.06,59.69 RN8.9 226.06,62.23 226.06,67.94 J2.CC
  Bottom 0.508: v131.44,37.47 125.73,37.47 121.28,33.02 111.76,33.02 109.86,34.92 E32.3 | v136.53,42.55 137.16,43.18 142.88,43.18 146.05,40.01 v162.56,40.01 | v181.61,14.61 v173.99,14.61 | v204.47,18.41 207.65,21.59 v224.79,21.59
BUS_CA_06_L  (via drill 0.61)
  Top 0.508: RN4.4 238.76,57.15 238.76,59.69 RN8.4 238.76,62.23 238.76,67.94 J2.PP | v90.17,90.81 90.17,66.04 88.9,64.77 E33.5 | v143.51,94.61 v139.7,90.81 | v171.45,96.52 171.45,72.39 v172.72,71.12
  Bottom 0.508: v139.7,90.81 v90.17,90.81 | v143.51,94.61 144.15,95.25 165.1,95.25 166.37,96.52 v171.45,96.52 | v172.72,71.12 175.26,73.66 243.21,73.66 245.75,71.12 245.75,66.67 241.3,66.67 239.4,68.58 J2.PP
BUS_CA_07_L  (via drill 0.61)
  Top 0.508: v90.17,60.33 90.17,59.69 87,56.52 E33.3 | RN4.7 230.5,56.52 229.87,57.15 229.87,59.69 230.5,60.33 RN8.7 231.14,62.23 231.14,67.94 J2.HH
  Bottom 0.508: v90.17,60.33 182.25,60.33 184.15,62.23 191.77,62.23 192.41,62.87 229.24,62.87 230.5,61.59 RN8.7
BUS_DATA&CLOCK_L  (via drill 0.61)
  Top 0.508: RN4.6 233.68,57.15 233.68,59.69 RN8.6 233.68,62.23 233.68,67.94 J2.KK | v184.78,58.42 184.78,67.94 182.88,69.85 182.88,92.71 E34.3 | v204.47,58.42 v204.47,65.41
  Bottom 0.508: v204.47,58.42 v184.78,58.42 | v204.47,65.41 229.24,65.41 233.04,61.59 RN8.6
BUS_DC_LO_L
  Top 0.508: R50.1 236.85,101.6 238.12,101.6 C53.1 238.76,100.97 240.03,99.69 240.03,85.72 241.3,84.45 J1.TT
BUS_FILE_READY
  Top 0.508: RN1.9 215.9,95.25 215.9,92.71 RN5.9 215.9,90.17 215.9,84.45 J1.V
BUS_HIGH_DENSITY_L
  Top 0.508: RN1.6 208.28,95.25 208.28,92.71 RN5.6 208.28,90.17 208.28,84.45 J1.N
BUS_INDEX_L  (via drill 0.61)
  Top 0.508: J1.Z 220.98,84.45 220.98,90.17 RN6.10 220.98,92.71 220.98,95.25 RN2.10 220.34,97.16 214.63,102.87 203.2,102.87 v203.2,130.18 | 52.07,133.35 57.78,139.06 E11.11 | 52.07,133.35 51.44,132.72 E11.1 | v147.96,130.18 143.51,125.73 143.51,96.52 144.78,95.25 v144.78,85.09 | v63.5,90.81 63.5,94.61 55.24,102.87 52.07,102.87 52.07,133.35
  Bottom 0.508: v147.96,130.18 v203.2,130.18 | v144.78,85.09 143.51,83.82 101.6,83.82 99.69,81.92 95.89,81.92 89.53,88.27 73.03,88.27 70.48,90.81 v63.5,90.81
BUS_READ_GATE_L
  Top 0.508: RN1.5 205.74,95.25 205.74,92.71 RN5.5 205.74,90.17 205.74,84.45 J1.L
BUS_RESTORE_L  (via drill 0.61)
  Top 0.508: RN3.8 210.82,57.15 210.82,59.69 RN7.8 210.82,62.23 210.82,67.94 J2.P | v43.18,59.69 43.18,62.23 38.1,67.31 E22.5 | v245.11,64.14 245.75,64.77 245.75,72.39 242.57,75.56 v242.57,76.2 | v181.61,87 179.07,89.53 v179.07,103.5 | v125.73,103.5 125.73,81.92 120.02,76.2 120.02,65.41 112.39,57.78 110.49,57.78 110.49,47.62 113.67,44.45 v113.67,31.75 | v76.2,29.21 69.22,36.2 v69.22,48.9
  Bottom 0.508: v43.18,59.69 46.99,55.88 47.62,55.88 C34.1 48.9,55.88 51.44,53.34 64.77,53.34 v69.22,48.9 | v245.11,64.14 240.03,64.14 237.49,66.67 213.36,66.67 211.46,68.58 J2.P | v242.57,76.2 239.4,79.38 189.23,79.38 v181.61,87 | v179.07,103.5 170.18,103.5 169.54,102.87 140.97,102.87 140.34,103.5 v125.73,103.5 | v113.67,31.75 111.12,29.21 v76.2,29.21
BUS_RWS_READY_L  (via drill 0.61)
  Top 0.508: v205.74,46.99 205.74,24.77 203.2,22.23 203.2,8.26 197.49,8.26 196.22,9.53 E12.5 | v227.33,46.99 228.6,48.26 228.6,54.61 RN4.8 228.6,57.15 228.6,59.69 RN8.8 228.6,62.23 228.6,67.94 J2.EE
  Bottom 0.508: v227.33,46.99 v205.74,46.99
BUS_SECTOR_ADDR_0L  (via drill 0.61)
  Top 0.508: RN2.8 226.06,95.25 226.06,92.71 RN6.8 226.06,90.17 226.06,84.45 J1.DD | v162.56,127.64 165.1,130.18 165.1,130.81 E6.5 | v201.93,124.46 v201.93,94.61
  Bottom 0.508: R17.1 137.79,127 138.43,127.64 v162.56,127.64 163.83,126.36 200.03,126.36 v201.93,124.46 | v201.93,94.61 224.16,94.61 225.43,95.89 RN2.8
BUS_SECTOR_ADDR_1L  (via drill 0.61)
  Top 0.508: J2.K 205.74,67.94 205.74,62.23 RN7.6 205.74,59.69 205.74,57.15 RN3.6 205.74,54.61 207.01,53.34 v207.01,39.37 | v123.19,126.36 123.19,127.64 121.92,128.91 R18.1 | E6.13 156.84,139.06 156.84,137.79 153.67,137.79 151.13,135.25 151.13,131.44 v144.78,125.09 144.78,116.84 150.5,116.84 153.03,114.3 153.03,110.49 v153.67,109.86 | v187.96,39.37 187.96,60.96 186.06,62.87 v186.06,89.53 | v167,95.25 160.02,102.23 v160.02,106.05
  Bottom 0.508: v123.19,126.36 124.46,125.09 v144.78,125.09 | v207.01,39.37 203.84,36.2 198.12,36.2 194.94,39.37 v187.96,39.37 | v186.06,89.53 183.51,92.08 177.16,92.08 176.53,92.71 176.53,95.25 v167,95.25 | v160.02,106.05 156.21,109.86 v153.67,109.86
BUS_SECTOR_ADDR_2L  (via drill 0.61)
  Top 0.508: J1.FF 228.6,84.45 228.6,90.17 RN6.7 228.6,92.71 228.6,95.25 RN2.7 227.97,97.16 224.16,100.97 224.16,101.6 R16.1 | v168.91,110.49 168.91,111.76 164.47,111.76 160.02,116.2 160.02,125.09 161.29,126.36 161.29,133.35 161.93,133.99 161.93,137.79 162.56,138.43 E6.11
  Bottom 0.508: v168.91,110.49 174.62,104.78 185.42,104.78 189.87,100.33 221.62,100.33 222.88,101.6 R16.1
BUS_SECTOR_ADDR_3L  (via drill 0.61)
  Top 0.508: J1.LL 233.68,84.45 233.68,90.17 RN6.5 233.68,92.71 233.68,95.25 RN2.5 233.04,97.16 231.78,98.42 231.78,99.06 R11.1 231.14,99.69 231.14,120.02 232.41,121.28 v232.41,136.53
  Bottom 0.508: v232.41,136.53 170.81,136.53 168.28,139.06 E6.9
BUS_SECTOR_PULSE_L
  Top 0.508: RN1.8 213.36,95.25 213.36,92.71 RN5.8 213.36,90.17 213.36,84.45 J1.T
BUS_SEEK_INCOMPLETE_L  (via drill 0.61)
  Top 0.508: RN3.4 200.66,57.15 200.66,59.69 RN7.4 200.66,62.23 200.66,67.94 J2.E | v190.5,65.41 189.87,66.04 v189.87,76.2 | v88.9,89.53 83.19,83.82 83.19,72.39 78.74,67.94 v78.74,66.04
  Bottom 0.508: E21.7 51.44,69.22 52.7,70.48 64.77,70.48 66.04,69.22 R27.1 66.67,68.58 69.22,66.04 v78.74,66.04 | v190.5,65.41 198.12,65.41 200.66,67.94 J2.E | v189.87,76.2 184.15,81.92 154.94,81.92 150.5,86.36 144.78,86.36 141.6,89.53 v88.9,89.53
BUS_STROBE_L  (via drill 0.61)
  Top 0.508: v127,82.55 128.27,83.82 v128.27,92.08 | v135.89,110.49 v135.89,92.08 | v186.69,115.57 187.96,114.3 v187.96,90.17 | RN2.3 238.12,95.89 237.49,95.25 237.49,92.71 238.12,92.08 RN6.3 238.76,90.17 238.76,84.45 J1.RR
  Bottom 0.508: v127,82.55 126.36,82.55 122.56,78.74 111.12,78.74 109.86,77.47 64.14,77.47 60.33,81.28 19.05,81.28 19.05,69.22 20.95,67.31 29.21,67.31 34.92,61.59 E22.3 | v135.89,92.08 v128.27,92.08 | v135.89,110.49 141.6,116.2 171.45,116.2 172.09,115.57 v186.69,115.57 | v187.96,90.17 188.59,89.53 236.85,89.53 238.12,90.81 RN6.3
BUS_WP_SET_L
  Top 0.508: RN1.4 203.2,95.25 203.2,92.71 RN5.4 203.2,90.17 203.2,84.45 J1.J
BUS_WP_STATUS_L
  Top 0.508: RN1.7 210.82,95.25 210.82,92.71 RN5.7 210.82,90.17 210.82,84.45 J1.R
BUS_WRITE_CK
  Top 0.508: RN2.6 231.14,95.25 231.14,92.71 RN6.6 231.14,90.17 231.14,84.45 J1.JJ
BUS_WRITE_GATE_L  (via drill 0.61)
  Top 0.508: RN2.9 223.52,95.25 223.52,92.71 RN6.9 223.52,90.17 223.52,84.45 J1.BB | v186.69,105.41 186.69,104.14 185.42,102.87 E34.5
  Bottom 0.508: v186.69,105.41 189.23,102.87 226.69,102.87 227.33,102.23 227.33,98.42 225.43,98.42 224.16,97.16 RN2.9
CA_SW_1  (via drill 0.61)
  Top 0.508: v109.22,106.05 109.22,102.87 E26.9
  Bottom 0.508: v109.22,106.05 111.12,107.95 115.57,107.95 116.84,109.22 118.11,109.22 CYL1.3 120.65,109.22 126.36,109.22 R45.2
CA_SW_2
  Top 0.508: E26.12 100.97,100.97 99.69,99.69 97.79,99.69 97.79,105.41 101.6,109.22 102.87,109.22 CYL2.3
  Bottom 0.508: R44.2 111.12,109.22 105.41,109.22 CYL2.3
CA_SW_4  (via drill 0.61)
  Top 0.508: v135.25,67.31 135.25,90.81 133.35,92.71 v133.35,109.22
  Bottom 0.508: CYL4.3 90.17,109.22 95.89,109.22 R43.2 97.16,109.22 99.69,111.76 104.78,111.76 106.05,113.03 108.58,113.03 109.22,112.39 130.18,112.39 v133.35,109.22 | v135.25,67.31 135.89,66.67 160.02,66.67 160.66,66.04 165.1,66.04 166.37,64.77 166.37,62.23 165.74,61.59 154.31,61.59 153.03,62.87 E27.9
CA_SW_8  (via drill 0.61)
  Top 0.508: v143.51,85.72 143.51,66.04 144.78,64.77 E27.12 | v122.56,88.27 116.84,93.98 116.84,100.97 113.03,104.78 v113.03,124.46 | v78.74,125.73 78.74,114.94 74.3,110.49 CYL8.3
  Bottom 0.508: R42.2 80.64,109.22 74.93,109.22 CYL8.3 | v143.51,85.72 140.97,88.27 v122.56,88.27 | v113.03,124.46 111.76,125.73 v78.74,125.73
CA_SW_16  (via drill 0.61)
  Top 0.508: v110.49,67.31 110.49,66.04 111.76,64.77 E28.9 | v72.39,67.31 72.39,75.56 67.94,80.01 67.94,92.71 66.04,94.61 66.04,108.58 R41.2
  Bottom 0.508: R41.2 65.41,109.22 59.69,109.22 CYL16.3 | v72.39,67.31 v110.49,67.31
CA_SW_32  (via drill 0.61)
  Top 0.508: R40.2 50.16,109.22 44.45,109.22 CYL32.3 | v100.33,74.3 100.33,68.58 104.14,64.77 E28.12 | v78.11,76.2 74.93,79.38 74.93,90.17 72.39,92.71 72.39,95.89 67.31,100.97 67.31,109.86 65.41,111.76 53.34,111.76 v53.34,110.49
  Bottom 0.508: v100.33,74.3 98.42,76.2 v78.11,76.2 | v53.34,110.49 52.07,109.22 51.44,109.22 R40.2
CA_SW_64  (via drill 0.61)
  Top 0.508: v93.98,81.92 93.98,44.45 E29.9 | v65.41,81.92 64.77,82.55 v64.77,110.49
  Bottom 0.508: v65.41,81.92 v93.98,81.92 | v64.77,110.49 63.5,111.76 38.73,111.76 36.2,109.22 R39.2 34.92,109.22 29.21,109.22 CYL64.3
CA_SW_128  (via drill 0.61)
  Top 0.508: v85.09,71.12 85.09,54.61 86.36,53.34 86.36,44.45 E29.12 | v23.5,72.39 22.86,73.03 22.86,96.52 20.32,99.06 20.32,108.58 R38.2
  Bottom 0.508: R38.2 19.68,109.22 13.97,109.22 CYL128.3 | v85.09,71.12 84.45,71.75 36.83,71.75 36.2,72.39 v23.5,72.39
CLOCK_H  (via drill 0.61)
  Top 0.508: v81.28,98.42 81.28,100.33 E7.10 81.28,102.87 81.28,107.31 82.55,108.58 v82.55,127
  Bottom 0.508: v81.28,98.42 72.39,98.42 72.39,102.87 73.03,103.5 74.3,103.5 75.56,102.23 E7.12 | E8.5 136.53,131.44 135.25,130.18 128.91,130.18 127.64,131.44 E8.1 126.36,131.44 122.56,127.64 83.19,127.64 v82.55,127
CONSTANT_WRITE_L  (via drill 0.61)
  Top 0.508: v102.87,141.6 102.87,135.89 100.33,133.35 100.33,126.36 99.06,125.09 99.06,116.2 103.5,111.76 v107.95,111.76 | v117.47,111.12 118.11,111.76 123.19,111.76 v123.19,107.95 | v144.78,107.95 146.69,109.86 146.69,111.76 148.59,113.67 CW.2
  Bottom 0.508: v102.87,141.6 64.77,141.6 64.77,138.43 59.05,132.72 E11.4 | v107.95,111.76 108.58,111.12 v117.47,111.12 | v144.78,107.95 v123.19,107.95
DATA_BITS
  Top 0.508: BIT2.3 224.79,109.22 219.07,109.22 R7.1
  Bottom 0.508: R7.1 217.81,109.22 212.09,109.22 BIT1.3 209.55,109.22 196.85,109.22 BIT0.3 | BIT3.3 240.03,109.86 239.4,110.49 226.69,110.49 BIT2.3
DC_ERASE  (via drill 0.61)
  Top 0.508: v93.34,133.99 88.9,138.43 E10.9 | v124.46,133.99 125.73,132.72 v125.73,123.83 | v136.53,122.56 142.24,116.84 v142.24,114.94
  Bottom 0.508: v124.46,133.99 v93.34,133.99 | v125.73,123.83 127,122.56 v136.53,122.56 | v142.24,114.94 144.78,112.39 158.12,112.39 159.38,113.67 163.83,113.67 DC_ERASE.2
FWD_L  (via drill 0.61)
  Top 0.508: 53.34,84.45 57.78,80.01 FWD/REV.3 | 53.34,84.45 51.44,86.36 R36.1 | v107.31,20.95 109.22,19.05 E17.9 | E16.9 83.82,19.05 85.09,20.32 v85.09,20.95 85.09,31.11 v83.82,32.38 | 53.34,84.45 48.26,79.38 48.26,71.12 46.99,69.85 46.99,41.27 48.26,40.01 v48.26,31.75
  Bottom 0.508: v85.09,20.95 v107.31,20.95 | v48.26,31.75 54.61,31.75 55.24,32.38 v83.82,32.38
GND  (via drill 0.61)
  Top 0.508: CYL16.NC@5 55.88,105.41 CYL16.NC@6 57.78,105.41 59.05,105.41 CYL16.NC@7 60.33,105.41 CYL16.NC@8 | CYL32.NC@8 45.09,105.41 CYL32.NC@7 43.81,105.41 42.55,105.41 CYL32.NC@6 | CYL32.NC@5 40.64,105.41 CYL32.NC@6 | CYL32.NC@6 41.27,107.31 41.27,111.76 42.55,113.03 CYL32.2 42.55,115.57 41.27,116.84 41.27,121.28 CYL32.NC@2 | CYL128.NC@8 14.61,105.41 CYL128.NC@7 13.34,105.41 12.06,105.41 CYL128.NC@6 | CYL128.NC@5 10.16,105.41 CYL128.NC@6 | CYL128.NC@6 10.79,107.31 10.79,111.76 12.06,113.03 CYL128.2 12.06,115.57 10.79,116.84 10.79,121.28 CYL128.NC@2 | CYL32.NC@2 40.64,122.56 CYL32.NC@1 | C11.2 48.26,131.44 46.99,130.18 46.99,125.09 CYL32.NC@3 45.72,122.56 CYL32.NC@4 43.81,121.28 42.55,121.28 CYL32.NC@2 | CYL128.NC@2 10.16,122.56 CYL128.NC@1 | CYL128.NC@2 12.06,121.28 13.34,121.28 CYL128.NC@4 15.24,122.56 CYL128.NC@3 17.14,123.19 23.5,123.19 CYL64.NC@1 25.4,122.56 CYL64.NC@2 27.3,121.28 28.57,121.28 CYL64.NC@4 30.48,122.56 CYL64.NC@3 | E26.7 111.76,92.71 111.76,87.63 POWER.1 | CYL1.NC@8 121.28,105.41 CYL1.NC@7 | CYL1.2 118.11,113.67 116.2,111.76 116.2,106.05 CYL1.NC@5 116.84,105.41 CYL1.NC@6 118.75,105.41 120.02,105.41 CYL1.NC@7 | CYL4.NC@5 86.36,105.41 CYL4.NC@6 | CYL4.NC@6 87,107.31 87,111.76 88.27,113.03 CYL4.2 88.27,115.57 87,116.84 87,121.28 CYL4.NC@2 | CYL2.NC@5 101.6,105.41 CYL2.NC@6 103.5,105.41 104.78,105.41 CYL2.NC@7 106.05,105.41 CYL2.NC@8 | E7.7 86.36,95.25 91.44,100.33 91.44,103.5 CYL4.NC@8 90.81,105.41 CYL4.NC@7 89.53,105.41 88.27,105.41 CYL4.NC@6 | C5.2 121.92,94.61 120.65,95.89 120.65,105.41 CYL1.NC@7 | CYL2.NC@3 106.68,122.56 CYL2.NC@4 104.78,121.28 103.5,121.28 CYL2.NC@2
  Top 0.508: CYL2.NC@2 101.6,122.56 CYL2.NC@1 | CYL2.2 103.5,115.57 102.23,116.84 102.23,121.28 CYL2.NC@2 | CYL1.NC@3 121.92,122.56 CYL1.NC@4 120.02,121.28 118.75,121.28 CYL1.NC@2 116.84,122.56 CYL1.NC@1 116.84,125.09 116.84,130.81 E24.7 116.84,133.35 116.84,135.89 114.3,138.43 E24.9 113.67,139.06 112.39,139.06 E24.10 | E24.13 104.78,139.06 106.05,139.06 E24.12 | CYL4.NC@2 86.36,122.56 CYL4.NC@1 | E10.7 91.44,130.81 91.44,125.09 CYL4.NC@3 91.44,122.56 CYL4.NC@4 89.53,121.28 88.27,121.28 CYL4.NC@2 | CYL8.NC@8 75.56,105.41 CYL8.NC@7 74.3,105.41 73.03,105.41 CYL8.NC@6 | CYL8.NC@5 71.12,105.41 CYL8.NC@6 | CYL8.NC@6 71.75,107.31 71.75,111.76 73.03,113.03 CYL8.2 73.03,115.57 71.75,116.84 71.75,121.28 CYL8.NC@2 | CYL16.NC@2 55.88,122.56 CYL16.NC@1 | CYL16.2 57.78,115.57 56.52,116.84 56.52,121.28 CYL16.NC@2 | CYL8.NC@2 71.12,122.56 CYL8.NC@1 | CYL8.NC@3 76.2,122.56 CYL8.NC@4 74.3,121.28 73.03,121.28 CYL8.NC@2 | E11.7 66.04,130.81 62.23,127 62.23,125.09 CYL16.NC@3 60.96,122.56 CYL16.NC@4 59.05,121.28 57.78,121.28 CYL16.NC@2 | E20.8 33.66,10.16 40.01,10.16 C19.2 40.64,10.79 40.64,11.43 45.72,16.51 E19.15 | C20.2 13.34,10.16 14.61,10.16 E20.1 15.24,11.43 15.24,13.97 17.78,16.51 E20.15 17.78,19.05 22.86,24.13 22.86,34.92 C23.2 | E23.7 40.64,36.83 42.55,38.73 42.55,52.7 C68.- 42.55,53.98 42.55,55.24 38.1,59.69 E22.4 | E32.4 111.76,34.29 112.39,33.66 112.39,19.68 113.03,19.05 113.03,12.7 111.76,11.43 E17.7 | 60.33,14.61 60.96,13.97 60.96,11.43 E19.8 61.59,10.16 67.94,10.16 C16.2 | 60.33,14.61 58.42,16.51 E19.10 | C29.2 78.74,36.2 82.55,40.01 82.55,64.77 81.92,65.41 80.01,65.41 78.74,64.14 C33.2
  Top 0.508: RUN.NC@5 25.4,74.93 RUN.NC@6 27.3,74.93 28.57,74.93 RUN.NC@7 | C22.2 27.94,61.59 27.94,64.77 29.21,66.04 29.21,74.93 RUN.NC@7 | RUN.NC@8 29.84,74.93 RUN.NC@7 | FWD/REV.NC@8 60.33,74.93 FWD/REV.NC@7 | FWD/REV.NC@7 60.33,76.83 60.33,81.28 59.05,82.55 FWD/REV.2 57.78,85.09 56.52,86.36 56.52,90.81 FWD/REV.NC@2 | FWD/REV.NC@7 59.05,74.93 57.78,74.93 FWD/REV.NC@6 55.88,74.93 FWD/REV.NC@5 54.61,73.03 54.61,63.5 55.88,62.23 E21.4 55.88,59.69 55.88,56.52 C34.2 55.88,55.24 55.88,48.9 62.23,42.55 FUNCTION.A 62.87,41.27 62.87,17.14 60.33,14.61 | RTZ.NC@8 45.09,74.93 RTZ.NC@7 43.81,74.93 42.55,74.93 RTZ.NC@6 | RTZ.NC@5 40.64,74.93 RTZ.NC@6 | RTZ.NC@6 41.27,76.83 41.27,81.28 42.55,82.55 RTZ.2 42.55,85.09 41.27,86.36 41.27,90.81 RTZ.NC@2 | CYL64.NC@8 29.84,105.41 CYL64.NC@7 28.57,105.41 27.3,105.41 CYL64.NC@6 | CYL64.NC@6 25.4,105.41 CYL64.NC@5 24.13,103.5 23.5,102.87 23.5,99.69 C60.- 23.5,98.42 24.13,97.79 24.13,94.61 RUN.NC@1 25.4,92.08 RUN.NC@2 27.3,90.81 28.57,90.81 RUN.NC@4 30.48,92.08 RUN.NC@3 | CYL64.2 27.3,113.03 26.04,111.76 26.04,107.31 CYL64.NC@6 | FWD/REV.NC@2 55.88,92.08 FWD/REV.NC@1 53.98,92.71 47.62,92.71 RTZ.NC@3 45.72,92.08 RTZ.NC@4 43.81,90.81 42.55,90.81 RTZ.NC@2 | FWD/REV.NC@3 60.96,92.08 FWD/REV.NC@4 59.05,90.81 57.78,90.81 FWD/REV.NC@2 | RTZ.NC@2 40.64,92.08 RTZ.NC@1 | v168.91,33.66 173.35,33.66 174.62,34.92 E30.4 | E15.12 164.47,17.14 163.19,17.14 E15.13 162.56,19.05 162.56,25.4 160.66,27.3 C67.- | E15.10 170.81,17.14 172.09,17.14 E15.9 172.72,16.51 172.72,13.97 173.35,13.34 | 173.35,13.34 175.26,11.43 E15.7 | 173.35,13.34 170.81,10.79 E15.5 169.54,9.53 168.28,9.53 E15.4 167.64,11.43 167.64,13.97 165.1,16.51 E15.12
  Top 0.508: C30.2 165.1,34.92 165.1,19.05 E15.12 | C41.2 248.28,60.96 247.01,60.96 RN8.1 246.38,59.69 245.11,58.42 245.11,47.62 243.84,46.35 R23.1 | E14.1 210.19,10.16 208.91,10.16 C14.2 | E12.7 200.66,11.43 200.66,13.97 198.12,16.51 E12.9 198.12,19.05 198.12,26.04 196.22,27.94 SECTOR.11 | SECTOR.12 191.13,27.94 195.58,27.94 SECTOR.11 | E13.4 245.75,9.53 244.47,8.26 236.22,8.26 236.22,9.53 C13.2 235.59,10.16 229.24,10.16 E14.8 228.6,11.43 228.6,16.51 E14.9 229.24,17.14 234.95,22.86 D5.A | BIT3.NC@5 238.76,105.41 BIT3.NC@6 240.66,105.41 241.94,105.41 BIT3.NC@7 243.21,105.41 BIT3.NC@8 | C43.2 245.75,91.44 244.47,91.44 RN6.1 | 245.11,103.5 246.38,102.23 C53.2 | 245.11,103.5 BIT3.NC@8 | 245.11,103.5 245.11,92.71 244.47,92.08 RN6.1 | 245.11,103.5 BIT3.NC@8 | BIT2.NC@5 223.52,105.41 BIT2.NC@6 225.43,105.41 226.69,105.41 BIT2.NC@7 227.97,105.41 BIT2.NC@8 | BIT0.NC@5 193.04,105.41 BIT0.NC@6 194.94,105.41 196.22,105.41 BIT0.NC@7 197.49,105.41 BIT0.NC@8 | BIT1.NC@5 208.28,105.41 BIT1.NC@6 210.19,105.41 211.46,105.41 BIT1.NC@7 212.72,105.41 BIT1.NC@8 | CW.NC@1 147.32,122.56 CW.NC@2 149.22,121.28 150.5,121.28 CW.NC@4 152.4,122.56 CW.NC@3 152.4,125.09 152.4,131.44 C6.2 | E8.8 144.78,133.35 144.78,138.43 E8.9 | DC_ERASE.NC@1 162.56,122.56 DC_ERASE.NC@2 164.47,121.28 165.74,121.28 DC_ERASE.NC@4 | E6.7 169.54,132.72 168.28,133.99 166.37,133.99 166.37,123.19 DC_ERASE.NC@4 | DC_ERASE.NC@3 167.64,122.56 DC_ERASE.NC@4 | BIT0.NC@3 198.12,122.56 BIT0.NC@4 196.22,121.28 194.94,121.28 | C2.2 202.56,132.08 196.22,132.08 E4.7 195.58,130.81 193.04,128.27 193.04,125.09 BIT0.NC@1 193.04,122.56 BIT0.NC@2
  Top 0.508: 194.94,121.28 194.94,120.02 BIT0.1 | 194.94,121.28 BIT0.NC@2 | 194.94,121.28 BIT0.NC@2 | BIT3.NC@1 238.76,122.56 BIT3.NC@2 240.66,121.28 240.66,120.02 BIT3.1 241.94,120.02 241.94,121.28 BIT3.NC@4 243.84,122.56 BIT3.NC@3 245.11,125.09 245.11,129.54 246.38,130.81 E1.7 | BIT1.NC@3 213.36,122.56 BIT1.NC@4 211.46,121.28 210.19,121.28 | BIT1.NC@2 208.28,122.56 BIT1.NC@1 | 210.19,121.28 210.19,120.02 BIT1.1 | BIT1.NC@2 210.19,121.28 | BIT1.NC@2 210.19,121.28 | BIT2.NC@1 223.52,122.56 BIT2.NC@2 225.43,121.28 225.43,120.02 BIT2.1 226.69,120.02 226.69,121.28 BIT2.NC@4 228.6,122.56 BIT2.NC@3 228.6,125.09 228.6,131.44 C1.2 | C27.2 137.16,56.52 138.43,57.78 138.43,69.85 139.06,70.48 C61.- | DRIVE.A 125.73,42.55 125.73,54.61 123.19,57.15 120.02,57.15 120.02,56.52 116.2,52.7 114.3,52.7 114.3,54.61 E28.7 | WRITE.NC@5 162.56,74.93 WRITE.NC@6 | WRITE.NC@8 167,74.93 WRITE.NC@7 165.74,74.93 164.47,74.93 WRITE.NC@6 | HEAD.NC@8 151.76,74.93 HEAD.NC@7 150.5,74.93 149.22,74.93 HEAD.NC@6 | HEAD.NC@5 147.32,74.93 HEAD.NC@6 | HEAD.3 149.22,78.11 149.22,76.83 HEAD.NC@6 | WRITE.NC@6 163.19,76.83 163.19,81.28 164.47,82.55 WRITE.2 164.47,85.09 163.19,86.36 163.19,90.81 WRITE.NC@2 | CW.NC@5 147.32,105.41 CW.NC@6 | CW.3 149.22,108.58 149.22,107.31 CW.NC@6 | CW.NC@6 149.22,105.41 150.5,105.41 CW.NC@7 151.76,105.41 CW.NC@8 153.03,103.5 153.03,94.61 HEAD.NC@3 152.4,92.08 HEAD.NC@4 150.5,90.81 149.22,90.81 HEAD.NC@2 147.32,92.08 HEAD.NC@1 | DC_ERASE.NC@5 162.56,105.41 DC_ERASE.NC@6 | DC_ERASE.NC@8 167,105.41 DC_ERASE.NC@7 165.74,105.41 164.47,105.41 DC_ERASE.NC@6 | DC_ERASE.3 164.47,108.58 164.47,107.31 DC_ERASE.NC@6
  Top 0.508: WRITE.NC@2 162.56,92.08 WRITE.NC@1 | WRITE.NC@3 167.64,92.08 WRITE.NC@4 165.74,90.81 164.47,90.81 WRITE.NC@2 | C42.2 193.68,91.44 194.94,91.44 RN5.1 195.58,90.17 195.58,84.45 J1.B 195.58,83.19 195.58,81.92 J1.A 196.22,81.28 197.49,81.28 J1.C 198.75,81.28 200.03,81.28 J1.E 201.29,81.28 202.56,81.28 J1.H 203.84,81.28 205.1,81.28 J1.K 206.38,81.28 207.65,81.28 J1.M 208.91,81.28 210.19,81.28 J1.P 211.46,81.28 212.72,81.28 J1.S 214,81.28 215.26,81.28 J1.U 216.53,81.28 217.81,81.28 J1.W 219.07,81.28 220.34,81.28 J1.Y 221.62,81.28 222.88,81.28 J1.AA 224.16,81.28 225.43,81.28 J1.CC 226.69,81.28 227.97,81.28 J1.EE 229.24,81.28 230.5,81.28 J1.HH 231.78,81.28 233.04,81.28 J1.KK 234.31,81.28 235.59,81.28 J1.MM 236.85,81.28 238.12,81.28 J1.PP 239.4,81.28 240.66,81.28 J1.SS | J1.SS 241.94,81.28 243.21,81.28 J1.UU 243.84,81.92 245.75,83.82 245.75,88.27 243.84,90.17 RN6.1 | J2.B 196.22,71.12 197.49,71.12 J2.D 198.75,71.12 200.03,71.12 J2.F 201.29,71.12 202.56,71.12 J2.J 203.84,71.12 205.1,71.12 J2.L 206.38,71.12 207.65,71.12 J2.N 208.91,71.12 210.19,71.12 J2.R 211.46,71.12 212.72,71.12 J2.T 214,71.12 215.26,71.12 J2.V 216.53,71.12 217.81,71.12 J2.X 219.07,71.12 220.34,71.12 J2.Z 221.62,71.12 222.88,71.12 J2.BB 224.16,71.12 225.43,71.12 J2.DD 226.69,71.12 227.97,71.12 J2.FF 229.24,71.12 230.5,71.12 J2.JJ 231.78,71.12 233.04,71.12 J2.LL 234.31,71.12 235.59,71.12 J2.NN 236.85,71.12 238.12,71.12 J2.RR 239.4,71.12 240.66,71.12 J2.TT | J2.VV 243.21,71.12 241.94,71.12 J2.TT | C40.2 190.5,61.59 188.59,63.5 188.59,67.94 C52.-
  Top 0.508: J1.SS 241.3,80.64 241.3,71.75 J2.TT | C45.+ 175.9,83.19 179.71,79.38 179.71,69.22 C44.- | SECTOR.11 195.58,29.21 193.04,31.75 193.04,53.34 191.77,54.61 191.77,58.42 193.04,59.69 RN7.1 | v95.25,87.63 95.25,59.05 96.52,57.78 96.52,56.52 C28.2
  Bottom 0.508: CYL16.NC@5 53.98,104.14 47.62,104.14 CYL32.NC@8 | CYL32.NC@1 38.73,123.19 32.38,123.19 CYL64.NC@3 | C5.2 121.28,93.98 112.39,93.98 E26.7 | 100.33,85.72 111.12,85.72 POWER.1 | 100.33,85.72 99.69,85.72 POWER_ON.B | E7.7 87,93.98 93.34,93.98 C26.2 | CYL2.NC@5 99.69,104.78 93.34,104.78 CYL4.NC@8 | CYL1.NC@5 114.94,104.14 108.58,104.14 CYL2.NC@8 | E24.12 107.31,140.34 108.58,141.6 109.86,141.6 111.12,140.34 E24.10 | C8.2 123.83,132.08 117.47,132.08 E24.7 | CYL2.NC@3 108.58,123.19 114.94,123.19 CYL1.NC@1 | C24.2 98.42,132.08 92.08,132.08 E10.7 | E11.7 66.67,132.08 73.03,132.08 C10.2 | CYL8.NC@1 69.22,123.19 62.87,123.19 CYL16.NC@3 | CYL4.NC@1 84.45,123.19 78.11,123.19 CYL8.NC@3 | CYL2.NC@1 99.69,123.19 93.34,123.19 CYL4.NC@3 | CYL16.NC@8 62.87,104.14 69.22,104.14 CYL8.NC@5 | E22.4 38.73,60.96 45.09,60.96 C21.2 45.72,60.33 50.16,55.88 55.24,55.88 C34.2 | C23.2 22.86,36.2 24.13,37.47 38.73,37.47 40.01,36.2 E23.7 | E20.8 32.38,10.79 31.11,12.06 23.5,12.06 18.41,17.14 E20.15 | E32.4 111.12,36.2 109.86,37.47 102.87,37.47 101.6,36.2 C32.2 100.97,35.56 97.16,35.56 E29.7 95.89,36.2 93.34,38.73 66.67,38.73 63.5,41.91 FUNCTION.A | E17.7 112.39,10.16 131.44,10.16 C18.2 | C17.2 93.34,10.16 87,10.16 E16.7 85.72,9.53 84.45,8.26 69.85,8.26 68.58,9.53 C16.2 | C7.2 67.94,93.98 62.87,93.98 FWD/REV.NC@3 | RTZ.NC@1 38.73,92.71 32.38,92.71 RUN.NC@3 | RUN.NC@8 32.38,73.66 38.73,73.66 RTZ.NC@5 | C33.2 78.11,63.5 76.2,61.59 56.52,61.59 E21.4 | CYL32.NC@5 38.73,104.14 32.38,104.14 CYL64.NC@8 | v168.91,33.66 166.37,33.66 165.1,34.92 C30.2 164.47,35.56 155.57,35.56 E31.4 154.31,34.92 153.03,33.66 146.05,33.66 144.78,34.92 C31.2
  Bottom 0.508: E18.7 150.5,10.16 156.84,10.16 C15.2 157.48,9.53 158.75,8.26 165.74,8.26 167,9.53 E15.4 | E15.7 175.9,10.16 182.25,10.16 C12.2 182.88,9.53 184.15,8.26 198.75,8.26 200.03,9.53 E12.7 201.29,10.16 207.65,10.16 C14.2 | R70.1 208.91,58.42 209.55,59.05 217.17,59.05 217.81,59.69 222.25,59.69 223.52,58.42 230.5,58.42 R148.1 231.78,58.42 243.84,58.42 245.75,60.33 RN8.1 | SECTOR.11 196.22,27.94 207.65,27.94 C38.2 208.91,27.94 210.19,26.67 221.62,26.67 222.88,25.4 R31.1 224.16,25.4 231.78,25.4 234.31,22.86 234.95,22.86 D5.A 236.85,23.5 237.49,23.5 237.49,41.91 | 237.49,41.91 233.04,41.91 231.78,40.64 C36.2 | 237.49,41.91 239.4,41.91 243.21,45.72 R23.1 | RN6.1 243.21,90.81 241.94,90.81 RN6.2 241.3,92.71 240.66,92.71 239.4,93.98 C39.2 | BIT0.NC@8 200.03,104.14 206.38,104.14 BIT1.NC@5 | BIT2.NC@5 221.62,104.14 215.26,104.14 BIT1.NC@8 | BIT3.NC@5 236.85,104.14 230.5,104.14 BIT2.NC@8 | E6.1 154.31,132.08 153.03,132.08 C6.2 151.76,132.08 145.41,132.08 E8.8 | E6.7 170.81,132.08 177.16,132.08 C4.2 | CW.NC@3 154.31,123.19 160.66,123.19 DC_ERASE.NC@1 | R15.1 183.51,116.84 189.87,123.19 191.13,123.19 BIT0.NC@1 191.13,123.83 169.54,123.83 DC_ERASE.NC@3 | E2.7 221.62,132.08 227.97,132.08 C1.2 | BIT1.NC@3 215.26,123.19 221.62,123.19 BIT2.NC@1 | BIT3.NC@1 236.85,123.19 230.5,123.19 BIT2.NC@3 | BIT0.NC@3 200.03,123.19 206.38,123.19 BIT1.NC@1 | BIT0.NC@6 193.68,107.31 193.68,118.75 194.31,118.75 BIT0.1 | E33.4 89.53,55.88 95.89,55.88 C28.2 96.52,56.52 97.79,57.78 112.39,57.78 113.67,56.52 E28.7 114.3,57.15 126.36,57.15 | 126.36,57.15 135.25,57.15 136.53,55.88 C27.2
  Bottom 0.508: C45.+ 174.62,83.19 166.37,83.19 WRITE.2 | WRITE.NC@5 160.66,73.66 154.31,73.66 HEAD.NC@8 | R14.1 172.09,111.76 168.28,111.76 166.37,109.86 DC_ERASE.3 | CW.NC@8 154.31,104.14 160.66,104.14 DC_ERASE.NC@5 | E5.7 140.34,93.34 145.41,93.34 HEAD.NC@1 | C9.2 174.62,93.98 169.54,93.98 WRITE.NC@3 | HEAD.NC@3 154.31,92.71 160.66,92.71 WRITE.NC@1 | E34.4 186.06,93.34 187.96,91.44 192.41,91.44 C42.2 | 182.88,57.78 182.88,59.69 190.5,59.69 | 182.88,57.78 182.88,57.15 E3.8 | 190.5,59.69 193.04,59.69 RN7.1 | 190.5,59.69 190.5,60.33 C40.2 | 182.88,57.78 163.83,57.78 162.56,56.52 C3.2 161.93,55.88 155.57,55.88 E27.7 154.31,55.24 153.03,53.98 149.22,53.98 148.59,53.34 126.36,53.34 126.36,57.15 | C44.- 180.97,68.58 187.32,68.58 C52.- 188.59,69.22 190.5,71.12 194.94,71.12 J2.B | 100.33,85.72 100.33,87.63 v95.25,87.63
HEAD_SELECT_L  (via drill 0.61)
  Top 0.508: RN1.10 218.44,95.25 218.44,92.71 RN5.10 218.44,90.17 218.44,84.45 J1.X | v158.12,80.64 158.75,81.28 v158.75,96.52
  Bottom 0.508: v158.12,80.64 153.67,80.64 151.13,83.19 HEAD.2 | v158.75,96.52 160.02,97.79 189.87,97.79 194.31,93.34 216.53,93.34 217.81,92.08 RN5.10
N$1
  Bottom 0.508: E12.6 198.75,10.79 200.03,12.06 208.28,12.06 209.55,10.79 209.55,8.26 236.85,8.26 238.12,9.53 E13.1
N$2